# EAGLE board msc_onlab106 (EAGLE 6.1)
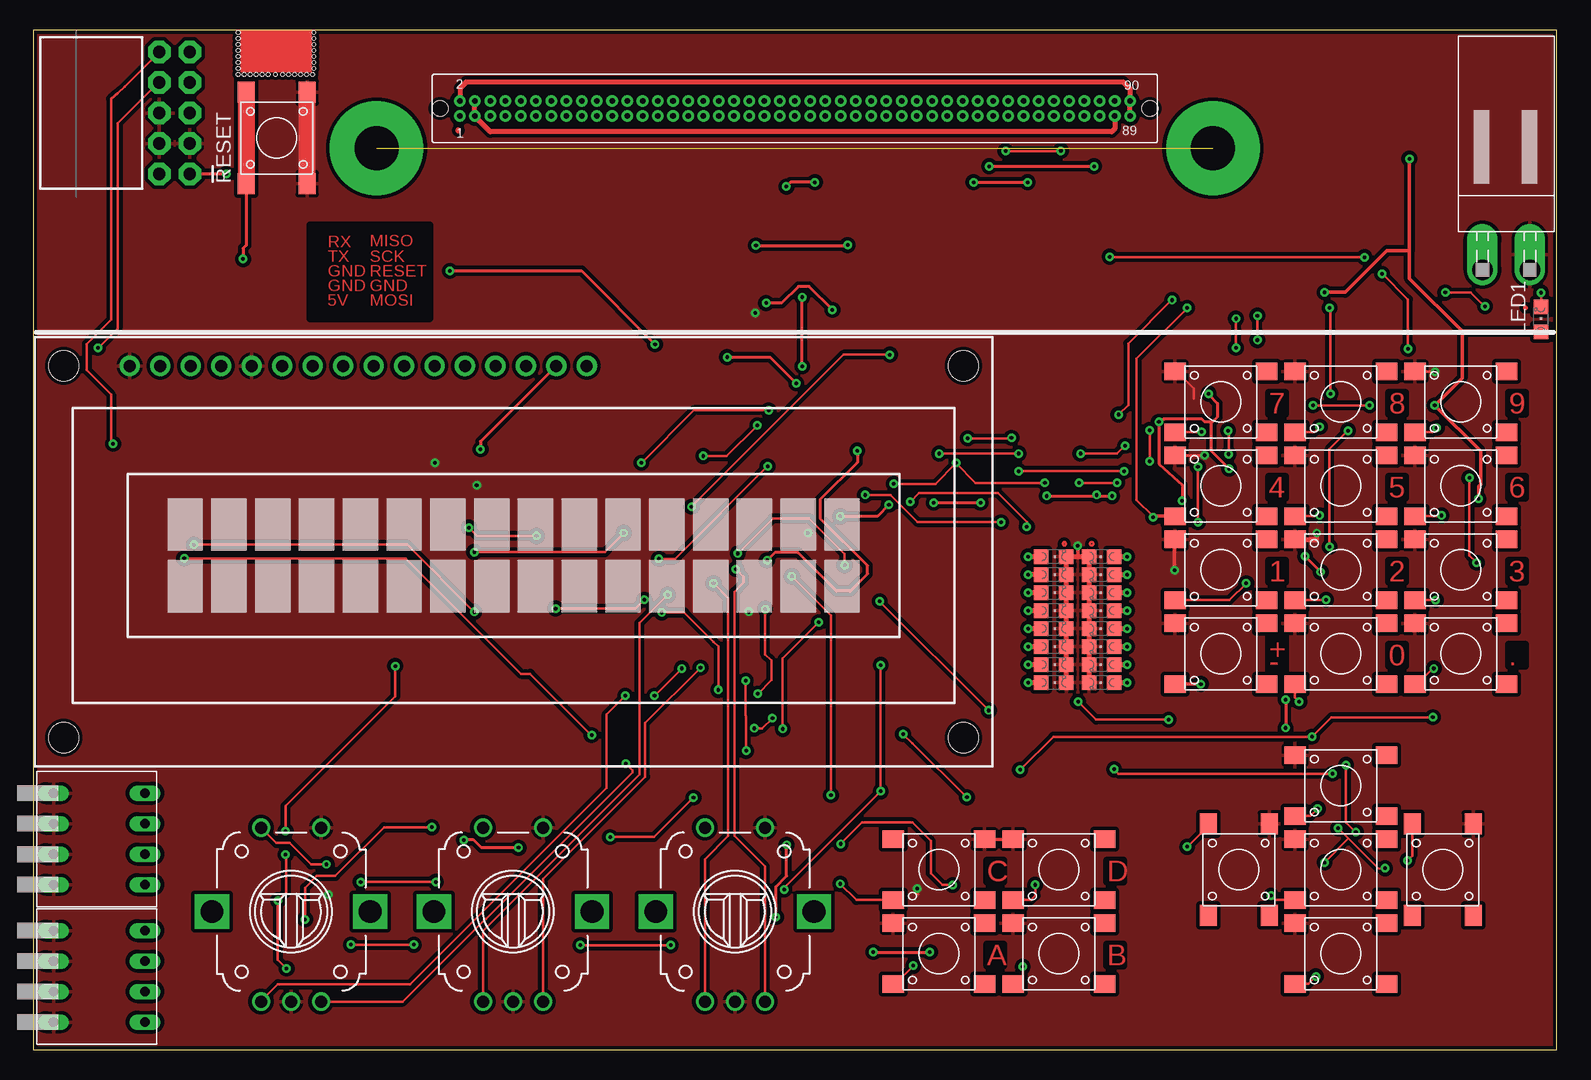
[diagram p2: board, top side]
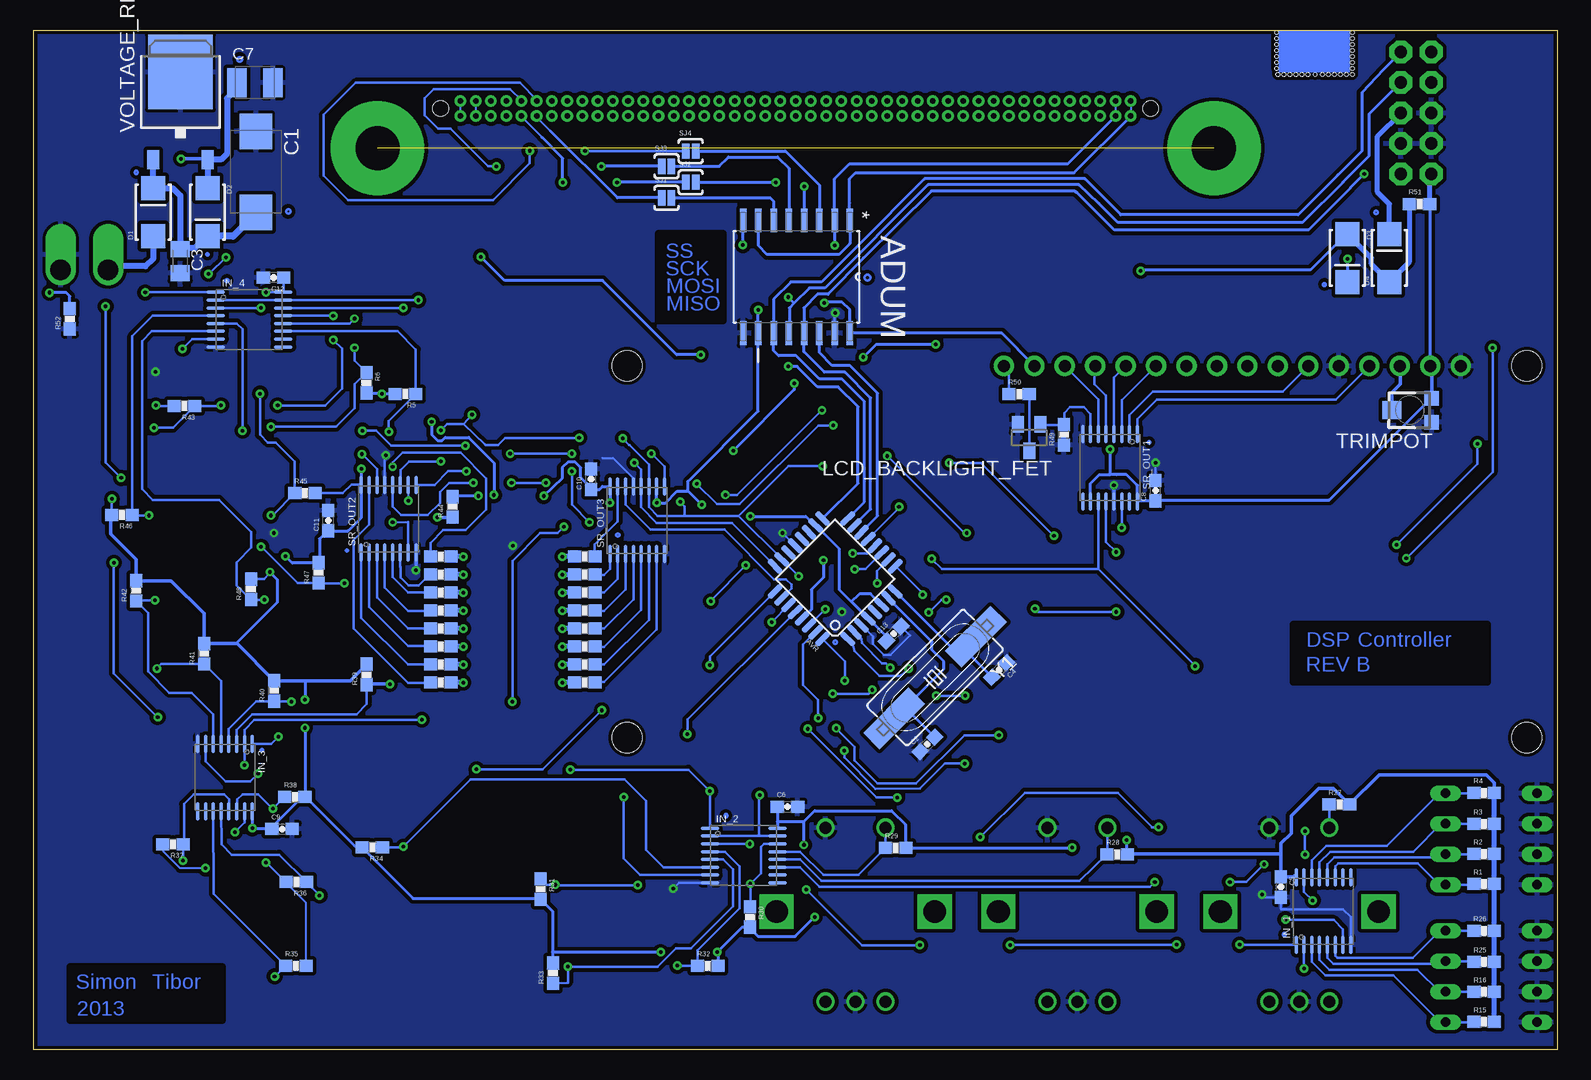
[diagram p3: board, bottom side, seen from below]

Size 127 x 85 mm. Coordinates in mm from the lower left corner, seen from the top.
Outline: 0,0 127,0 127,85 0,85 0,0
Copper layers (1*16): Top 0.035mm / dielectric 1.5mm / Bottom 0.035mm
Design rules: minimum track width 7mil, minimum drill 0.3mm, track to track 8mil, track to pad 8mil, pad to pad 7mil, via to via 7mil, smd to smd 7mil, copper to edge 10mil, drill to drill 7mil, minimum pad ring 10mil, minimum via ring 8mil, stop-mask expansion 2mil, vias tented up to drill 30mil, thermal gap 10mil
Holes 0.3 mm at 17.1,84.8 17.1,84.3 17.1,83.8 17.1,83.3 17.1,82.8 17.1,82.3 17.1,81.8 17.1,81.3 17.6,81.3 18.1,81.3 18.6,81.3 19.1,81.3 19.6,81.3 20.2,81.3 20.8,81.3 21.3,81.3 21.8,81.3 22.3,81.3 22.8,81.3 23.3,81.3 23.4,81.8 23.4,82.3 23.4,82.8 23.4,83.3 23.4,83.8 23.4,84.3 23.4,84.8
tRestrict: area 23.1,60.9 to 33.1,68.7
bRestrict: area 5.8,30.6 to 22,35.4; area 111.3,2.4 to 124,6.9; area 69.5,60.8 to 74.9,68

## Footprints (pad centres in the part's own frame; a part is rotated, then mirrored left to right if it is on the bottom)
SMD = smd 1.778 x 1.422: P$1 3.81,-2.54; P$2 -3.81,-2.54; P$3 3.81,2.54; P$4 -3.81,2.54
SOIC127P1032X265-16N = smd 1.981 x 0.533: 1 -4.699,4.445; 2 -4.699,3.175; 3 -4.699,1.905; 4 -4.699,0.635; 5 -4.699,-0.635; 6 -4.699,-1.905; 7 -4.699,-3.175; 8 -4.699,-4.445; 9 4.699,-4.445; 10 4.699,-3.175; 11 4.699,-1.905; 12 4.699,-0.635; 13 4.699,0.635; 14 4.699,1.905; 15 4.699,3.175; 16 4.699,4.445
TQFP32-08 = smd 1.524 x 0.559: 1 -4.293,2.8; 2 -4.293,2; 3 -4.293,1.2; 4 -4.293,0.4; 5 -4.293,-0.4; 6 -4.293,-1.2; 7 -4.293,-2; 8 -4.293,-2.8; 17 4.293,-2.8; 18 4.293,-2; 19 4.293,-1.2; 20 4.293,-0.4; 21 4.293,0.4; 22 4.293,1.2; 23 4.293,2; 24 4.293,2.8 | smd 0.559 x 1.524: 9 -2.8,-4.293; 10 -2,-4.293; 11 -1.2,-4.293; 12 -0.4,-4.293; 13 0.4,-4.293; 14 1.2,-4.293; 15 2,-4.293; 16 2.8,-4.293; 25 2.8,4.293; 26 2,4.293; 27 1.2,4.293; 28 0.4,4.293; 29 -0.4,4.293; 30 -1.2,4.293; 31 -2,4.293; 32 -2.8,4.293
D/7343-31W = smd 2.95 x 2.7: + 3.375,0; - -3.375,0
0603-CAP = smd 1.1 x 1: 1 -0.85,0; 2 0.85,0
C0805K = smd 1.3 x 1.6: 1 -1,0; 2 1,0
SMC_B = smd 1.6 x 2.4: + -1.5,0; - 1.5,0
SAMTEC-TFC = drill 0.46 pad 0.9: 1 27.94,0.635; 2 27.94,-0.635; 3 26.67,0.635; 4 26.67,-0.635; 5 25.4,0.635; 6 25.4,-0.635; 7 24.13,0.635; 8 24.13,-0.635; 9 22.86,0.635; 10 22.86,-0.635; 11 21.59,0.635; 12 21.59,-0.635; 13 20.32,0.635; 14 20.32,-0.635; 15 19.05,0.635; 16 19.05,-0.635; 17 17.78,0.635; 18 17.78,-0.635; 19 16.51,0.635; 20 16.51,-0.635; 21 15.24,0.635; 22 15.24,-0.635; 23 13.97,0.635; 24 13.97,-0.635; 25 12.7,0.635; 26 12.7,-0.635; 27 11.43,0.635; 28 11.43,-0.635; 29 10.16,0.635; 30 10.16,-0.635; 31 8.89,0.635; 32 8.89,-0.635; 33 7.62,0.635; 34 7.62,-0.635; 35 6.35,0.635; 36 6.35,-0.635; 37 5.08,0.635; 38 5.08,-0.635; 39 3.81,0.635; 40 3.81,-0.635; 41 2.54,0.635; 42 2.54,-0.635; 43 1.27,0.635; 44 1.27,-0.635; 45 0,0.635; 46 0,-0.635; 47 -1.27,0.635; 48 -1.27,-0.635; 49 -2.54,0.635; 50 -2.54,-0.635; 51 -3.81,0.635; 52 -3.81,-0.635; 53 -5.08,0.635; 54 -5.08,-0.635; 55 -6.35,0.635; 56 -6.35,-0.635; 57 -7.62,0.635; 58 -7.62,-0.635; 59 -8.89,0.635; 60 -8.89,-0.635; 61 -10.16,0.635; 62 -10.16,-0.635; 63 -11.43,0.635; 64 -11.43,-0.635; 65 -12.7,0.635; 66 -12.7,-0.635; 67 -13.97,0.635; 68 -13.97,-0.635; 69 -15.24,0.635; 70 -15.24,-0.635; 71 -16.51,0.635; 72 -16.51,-0.635; 73 -17.78,0.635; 74 -17.78,-0.635; 75 -19.05,0.635; 76 -19.05,-0.635; 77 -20.32,0.635; 78 -20.32,-0.635; 79 -21.59,0.635; 80 -21.59,-0.635; 81 -22.86,0.635; 82 -22.86,-0.635; 83 -24.13,0.635; 84 -24.13,-0.635; 85 -25.4,0.635; 86 -25.4,-0.635; 87 -26.67,0.635; 88 -26.67,-0.635; 89 -27.94,0.635; 90 -27.94,-0.635 | hole 1.3: -29.6,0; 29.587,0
SMA-DIODE_ALT = smd 2 x 2: A -2,0; C 2,0
DIP04PIANO = drill 0.8 long: 11 -3.81,-2.69; 12 -3.81,4.93; 21 -1.27,-2.69; 22 -1.27,4.93; 31 1.27,-2.69; 32 1.27,4.93; 41 3.81,-2.69; 42 3.81,4.93
PEC12_INCREMENTAL_ENCODER = drill 1: A -2.5,-7.5; B 2.5,-7.5; C 0,-7.5; P1 -2.5,7; P2 2.5,7 | drill 1.9 square: GND@1 -6.6,0; GND@2 6.6,0
TI_PW = smd 0.3 x 1.55: 1 -2.275,-2.8; 2 -1.625,-2.8; 3 -0.975,-2.8; 4 -0.325,-2.8; 5 0.325,-2.8; 6 0.975,-2.8; 7 1.625,-2.8; 8 2.275,-2.8; 9 2.275,2.825; 10 1.625,2.825; 11 0.975,2.825; 12 0.325,2.825; 13 -0.325,2.825; 14 -0.975,2.825; 15 -1.625,2.825; 16 -2.275,2.825
TUXGR_16X2_R2 = drill 1 pad 1.676: 1 -32,15.5; 2 -29.46,15.5; 3 -26.92,15.5; 4 -24.38,15.5; 5 -21.84,15.5; 6 -19.3,15.5; 7 -16.76,15.5; 8 -14.22,15.5; 9 -11.68,15.5; 10 -9.14,15.5; 11 -6.6,15.5; 12 -4.06,15.5; 13 -1.52,15.5; 14 1.02,15.5; 15 3.56,15.5; 16 6.1,15.5 | hole 2.5: -37.5,-15.5; 37.5,-15.5; -37.5,15.5; 37.5,15.5
SOT23 = smd 1 x 1.4: 1 -0.95,-1.1; 2 0.95,-1.1; 3 0,1.1
CHIPLED_0805 = smd 1.2 x 1.2: A 0,-1.05; C 0,1.05
NSL39_2_CONNECTOR = drill 1.7 offset: P$1 0,1.98; P$2 0,-1.98
2X5-RAF = drill 1.016 pad 1.88 octagon: 1 -1.27,5.08; 2 1.27,5.08; 3 -1.27,2.54; 4 1.27,2.54; 5 -1.27,0; 6 1.27,0; 7 -1.27,-2.54; 8 1.27,-2.54; 9 -1.27,-5.08; 10 1.27,-5.08
0603-RES = smd 1.1 x 1: 1 -0.85,0; 2 0.85,0
SJ_2S-NOTRACE = smd 0.635 x 1.27: 1 -0.401,0; 2 0.413,0
TC33X = smd 1.2 x 1.2: 1 -1,-1.825; 3 1,-1.825 | smd 1.5 x 1.6: 2 0,1.5
TO252 = smd 1 x 1.6: 1 -2.28,-4.8; 2 2.28,-4.8 | smd 5.4 x 6.2: 3 0,2.5
HC49UP = smd 5.334 x 1.93: 1 -4.826,0; 2 4.826,0

## Placement (x,y rotation side)
A1  TACTM-67N  [SMD]  109,22 0 top
A2  TACTM-67N  [SMD]  100.5,15 270 top
A3  TACTM-67N  [SMD]  109,15 0 top
A4  TACTM-67N  [SMD]  117.5,15 270 top
A5  TACTM-67N  [SMD]  109,8 0 top
ADUM  ADUM1401BRWZ  [SOIC127P1032X265-16N]  63.43,64.42 270 bottom
AVR  ATMEGA168  [TQFP32-08]  60.21,39.24 135 bottom
C1  47u  [D/7343-31W]  108.49,73.18 270 bottom
C2  22p  [0603-CAP]  52.51,25.44 45 bottom
C3  100n  [C0805K]  114.8,65.73 270 bottom
C4  22p  [0603-CAP]  46.54,31.65 225 bottom
C5  1u  [0603-CAP]  23.05,13.55 270 bottom
C6  1u  [0603-CAP]  64.18,20.24 0 bottom
C7  22u  [SMC_B]  108.57,80.61 0 bottom
C8  1u  [0603-CAP]  33.5,46.6 90 bottom
C9  1u  [0603-CAP]  106.31,18.38 0 bottom
C10  1u  [0603-CAP]  80.55,47.55 90 bottom
C11  1u  [0603-CAP]  102.45,44.1 90 bottom
C12  1u  [0603-CAP]  107.02,64.35 180 bottom
C13  1u  [0603-CAP]  55.33,34.67 45 bottom
CONNECTOR  SAMTEC_TFC  [SAMTEC-TFC]  63.5,78.46 180 top
D1  TACTM-67N  [SMA-DIODE_ALT]  117.05,69.81 90 bottom
D2  TACTM-67N  [SMA-DIODE_ALT]  112.53,69.81 270 bottom
D3  TACTM-67N  [SMA-DIODE_ALT]  17.5,66 270 bottom
D4  TACTM-67N  [SMA-DIODE_ALT]  14,66 90 bottom
DIP1  DIP04PIANO  [DIP04PIANO]  4.39,17.55 270 top
DIP2  DIP04PIANO  [DIP04PIANO]  4.39,6.09 270 top
E1  ENCODER_SW1-PEC12  [PEC12_INCREMENTAL_ENCODER]  21.5,11.5 0 top
E2  ENCODER_SW1-PEC12  [PEC12_INCREMENTAL_ENCODER]  40,11.5 0 top
E3  ENCODER_SW1-PEC12  [PEC12_INCREMENTAL_ENCODER]  58.5,11.5 0 top
F1  TACTM-67N  [SMD]  75.5,15 0 top
F2  TACTM-67N  [SMD]  85.5,15 0 top
F3  TACTM-67N  [SMD]  75.5,8 0 top
F4  TACTM-67N  [SMD]  85.5,8 0 top
IN_1  74HC165  [TI_PW]  19.5,11.54 0 bottom
IN_2  74HC165  [TI_PW]  67.85,16.17 270 bottom
IN_3  74HC165  [TI_PW]  111.07,22.67 180 bottom
IN_4  74HC165  [TI_PW]  109.04,60.86 270 bottom
LCD  RC-1602-BB  [TUXGR_16X2_R2]  40.05,41.5 0 top
LCD_BACKLIGHT_FET  BSS 138  [SOT23]  44.03,51.02 180 bottom
LED1  [CHIPLED_0805]  125.68,60.87 0 top
LED17  OF-SMD 2012 R/Y/G  [CHIPLED_0805]  89.08,30.59 90 top
LED18  OF-SMD 2012 R/Y/G  [CHIPLED_0805]  89.08,32.09 90 top
LED19  OF-SMD 2012 R/Y/G  [CHIPLED_0805]  89.08,33.59 90 top
LED20  OF-SMD 2012 R/Y/G  [CHIPLED_0805]  89.08,35.09 90 top
LED21  OF-SMD 2012 R/Y/G  [CHIPLED_0805]  89.08,36.59 90 top
LED22  OF-SMD 2012 R/Y/G  [CHIPLED_0805]  89.08,38.09 90 top
LED23  OF-SMD 2012 R/Y/G  [CHIPLED_0805]  89.08,39.59 90 top
LED24  OF-SMD 2012 R/Y/G  [CHIPLED_0805]  89.08,41.09 90 top
LED25  OF-SMD 2012 R/Y/G  [CHIPLED_0805]  85.08,41.09 270 top
LED26  OF-SMD 2012 R/Y/G  [CHIPLED_0805]  85.08,39.59 270 top
LED27  OF-SMD 2012 R/Y/G  [CHIPLED_0805]  85.08,38.09 270 top
LED28  OF-SMD 2012 R/Y/G  [CHIPLED_0805]  85.08,36.59 270 top
LED29  OF-SMD 2012 R/Y/G  [CHIPLED_0805]  85.08,35.09 270 top
LED30  OF-SMD 2012 R/Y/G  [CHIPLED_0805]  85.08,33.59 270 top
LED31  OF-SMD 2012 R/Y/G  [CHIPLED_0805]  85.08,32.09 270 top
LED32  OF-SMD 2012 R/Y/G  [CHIPLED_0805]  85.08,30.59 270 top
N1  TACTM-67N  [SMD]  99,54 0 top
N2  TACTM-67N  [SMD]  109,54 0 top
N3  TACTM-67N  [SMD]  119,54 0 top
N4  TACTM-67N  [SMD]  99,47 0 top
N5  TACTM-67N  [SMD]  109,47 0 top
N6  TACTM-67N  [SMD]  119,47 0 top
N7  TACTM-67N  [SMD]  99,40 0 top
N8  TACTM-67N  [SMD]  109,40 0 top
N9  TACTM-67N  [SMD]  119,40 0 top
N10  TACTM-67N  [SMD]  99,33 0 top
N11  TACTM-67N  [SMD]  109,33 0 top
N12  TACTM-67N  [SMD]  119,33 0 top
POWER_CONNECTOR  NSL39_2_CONNECTOR  [NSL39_2_CONNECTOR]  122.79,64.99 270 top
PROGRAMMING_CONNECTOR  M05X2RAF  [2X5-RAF]  11.78,78.08 180 top
R1  10k  [0603-RES]  6.1,13.8 0 bottom
R2  10k  [0603-RES]  6.1,16.3 0 bottom
R3  10k  [0603-RES]  6.1,18.8 0 bottom
R4  10k  [0603-RES]  6.1,21.4 0 bottom
R5  10k  [0603-RES]  96.03,54.66 180 bottom
R6  10k  [0603-RES]  99.28,55.6 270 bottom
R7  1k  [0603-RES]  93.08,30.59 0 bottom
R8  1k  [0603-RES]  93.08,32.09 0 bottom
R9  1k  [0603-RES]  93.08,33.59 0 bottom
R10  1k  [0603-RES]  93.08,35.09 0 bottom
R11  1k  [0603-RES]  93.08,36.59 0 bottom
R12  1k  [0603-RES]  93.08,38.09 0 bottom
R13  1k  [0603-RES]  93.08,39.59 0 bottom
R14  1k  [0603-RES]  93.08,41.09 0 bottom
R15  10k  [0603-RES]  6.1,2.3 0 bottom
R16  10k  [0603-RES]  6.1,4.8 0 bottom
R17  1k  [0603-RES]  81.08,41.09 180 bottom
R18  1k  [0603-RES]  81.08,39.59 180 bottom
R19  1k  [0603-RES]  81.08,38.09 180 bottom
R20  1k  [0603-RES]  81.08,36.59 180 bottom
R21  1k  [0603-RES]  81.08,35.09 180 bottom
R22  1k  [0603-RES]  81.08,33.59 180 bottom
R23  1k  [0603-RES]  81.08,32.09 180 bottom
R24  1k  [0603-RES]  81.08,30.59 180 bottom
R25  10k  [0603-RES]  6.1,7.3 0 bottom
R26  10k  [0603-RES]  6.1,9.9 0 bottom
R27  10k  [0603-RES]  18.18,20.43 0 bottom
R28  10k  [0603-RES]  36.69,16.27 0 bottom
R29  10k  [0603-RES]  55.15,16.82 0 bottom
R30  10k  [0603-RES]  67.31,11.06 270 bottom
R31  10k  [0603-RES]  84.76,13.37 270 bottom
R32  10k  [0603-RES]  70.82,6.98 0 bottom
R33  10k  [0603-RES]  83.71,6.36 90 bottom
R34  10k  [0603-RES]  98.79,16.86 180 bottom
R35  10k  [0603-RES]  105.16,6.98 0 bottom
R36  10k  [0603-RES]  105.13,13.96 180 bottom
R37  10k  [0603-RES]  115.41,17.12 180 bottom
R38  10k  [0603-RES]  105.25,21.06 0 bottom
R39  10k  [0603-RES]  99.26,31.27 90 bottom
R40  10k  [0603-RES]  106.98,29.9 90 bottom
R41  10k  [0603-RES]  112.81,32.99 90 bottom
R42  10k  [0603-RES]  118.47,38.24 90 bottom
R43  10k  [0603-RES]  114.45,53.64 180 bottom
R44  10k  [0603-RES]  92.08,45.24 90 bottom
R45  10k  [0603-RES]  104.39,46.39 0 bottom
R46  10k  [0603-RES]  119.66,44.58 180 bottom
R47  10k  [0603-RES]  103.26,39.74 90 bottom
R48  10k  [0603-RES]  108.91,38.36 90 bottom
R49  10k  [0603-RES]  41.14,51.24 90 bottom
R50  20  [0603-RES]  44.88,54.64 0 bottom
R51  10k  [0603-RES]  11.5,70.5 0 bottom
R52  550  [0603-RES]  124,60.93 90 bottom
RESET  NSG 39-2  [SMD]  20.3,76 90 top
SJ1  SOLDERJUMPERNC2  [SJ_2S-NOTRACE]  74.26,71 0 bottom
SJ2  SOLDERJUMPERNC2  [SJ_2S-NOTRACE]  72.25,72.3 0 bottom
SJ3  SOLDERJUMPERNC2  [SJ_2S-NOTRACE]  74.26,73.64 0 bottom
SJ4  SOLDERJUMPERNC2  [SJ_2S-NOTRACE]  72.25,74.9 0 bottom
SR_OUT1  74HC595  [TI_PW]  37.29,48.51 180 bottom
SR_OUT2  74HC595  [TI_PW]  97.42,44.25 0 bottom
SR_OUT3  74HC595  [TI_PW]  76.7,44.12 0 bottom
TRIMPOT  10k  [TC33X]  12.3,53.3 90 bottom
VOLTAGE_REGULATOR  7805DT  [TO252]  114.78,78.99 0 bottom
Y1  16MHz  [HC49UP]  51.88,31.01 225 bottom

## Tracks (layer width: path | path; a pad name or v marks a point on that pad's centre or on a via)
3V3
  Top 0.254: 35.55,79.1 CONNECTOR.2
  Top 0.406: CONNECTOR.89 91.44,79.06 91.45,79.06 91.45,80.08 90.88,80.65 36.08,80.65 35.59,80.16 35.59,79.14 35.55,79.1
  Bottom 0.178: CONNECTOR.90 CONNECTOR.89 | CONNECTOR.2 CONNECTOR.1
  Bottom 0.254: CONNECTOR.1 40.28,73.1 58.5,73.1 59,72.6 59,70.58 ADUM.1 58.99,67.2 59.9,66.29 65.88,66.29 66.59,67 66.59,69.1 ADUM.7
3V3_GND  (via drill 0.3)
  Top 0.254: 36.81,79.1 36.82,79.1 CONNECTOR.4 | v60.26,67.04 67.86,67.04 v67.89,67.07
  Top 0.406: CONNECTOR.87 90.17,76.77 89.9,76.5 38.11,76.5 36.81,77.8 36.81,79.1
  Bottom 0.178: CONNECTOR.88 CONNECTOR.87 | CONNECTOR.4 CONNECTOR.3
  Bottom 0.254: CONNECTOR.3 40.8,73.85 59,73.85 60.26,72.59 ADUM.2 v60.26,67.04 | v67.89,67.07 67.89,69.1 ADUM.8
5V  (via drill 0.3)
  Top 0.178: 43.55,56.96 LCD.15 | v112.69,15.11 112.12,15.11 109.65,17.59 | v108.79,18.44 109.65,17.59 | 109.65,17.59 v107.66,15.6 | 98.31,52.33 98.23,52.33 | 97.99,54.6 v97.99,54.68 | v88.64,46.23 88.64,46.15 | v93.84,52.33 93.92,52.24 93.84,52.24
  Top 0.203: v97.99,54.68 97.83,54.68 | v116.84,53.71 116.76,53.71 116.67,53.62 | v120.49,45.91 120.49,45.74 | v107.66,63.13 107.58,63.13 | v95.79,45.74 95.79,45.91
  Top 0.254: v61.1,62.24 62.4,62.24 63.78,63.62 64.67,63.62 v66.62,61.67 | v37.29,50.05 37.29,50.7 43.55,56.96 | v70.04,8.12 v74.75,8.12 | v62.81,17.06 62.81,14.46 61.91,13.57 v61.91,11.05 | v84.5,46.15 88.64,46.15 v89.94,46.15 | v78.97,45.58 v75.08,45.58 | v67.28,44.44 70.36,44.44 v71.34,45.42 | v95.79,45.74 95.79,47.04 93.84,48.83 93.84,52.24 94.25,52.57 97.42,52.57 97.66,52.33 98.23,52.33 98.23,49.89 v99.69,48.42 | 98.31,52.33 98.72,52.73 98.72,53.87 97.99,54.6 | v106.03,41.11 v107.33,39.81 | v104.41,29.17 v104.41,26.81 | v35.91,17.47 36.73,17.47 37.38,16.82 v40.46,16.82
  Top 0.305: v114.72,74.26 114.72,66.62 | 119.11,59.88 114.72,64.27 114.72,66.62 | 119.11,59.88 125.61,59.88 LED1.A | LED1.A | LED1.A 125.69,59.8 | 114.72,66.62 112.86,66.62 109.36,63.13 v107.66,63.13 | 119.11,59.88 119.11,55.98 v116.84,53.71 120.66,49.89 120.66,47.12 120.49,46.96 v120.49,45.91
  Bottom 0.178: 66.62,59.88 66.54,59.8 ADUM.10 66.62,59.64 | 58.99,59.8 ADUM.16 58.91,59.72 | 10.64,57.12 LCD.2 | 10.64,70.36 R51.2 | 38.92,46.31 SR_OUT1.10 | 36.64,47.94 36.73,47.94 | 10.89,53.95 10.56,54.19 TRIMPOT.3 | 33.48,45.83 C8.1 | 43.63,57.04 LCD.15 | 54.36,16.82 R29.2 54.27,16.82 | 83.77,7.23 R33.2 | 84.74,12.51 R31.2 84.83,12.59 | 69.96,6.99 R32.2 | v70.04,8.12 69.96,8.12 | 67.44,10.56 R30.2 | 92.06,46.15 R44.2 | 80.52,46.8 C10.1 | 61.91,43.71 AVR.18 | 74.99,45.58 v75.08,45.58 | 100.18,16.9 99.69,16.9 R34.2 99.61,16.82 | 104.33,21.04 R38.2 | R35.2 104.33,6.99 104.33,12.27 105.95,13.89 R36.2 106.03,13.97 v107.66,15.6 | 107.58,18.44 107.17,18.61 C9.1 107.09,18.61 | 108.79,19.82 IN_3.16 | v112.69,15.11 114.81,15.11 116.19,16.49 116.19,17.06 R37.2 | 104.65,21.04 104.49,21.04 R38.2 | v95.79,45.74 95.79,47.04 SR_OUT2.10 | 103.19,40.62 R47.2 103.27,40.54 | 102.54,43.23 C11.1 | 108.88,39.24 R48.2 | 99.69,47.12 SR_OUT2.16 | 110.01,33.96 110.07,33.84 | 104.41,21.12 R38.2
  Bottom 0.203: 97.96,54.66 v97.99,54.68 | v97.99,54.69 v97.99,54.68 | R43.2 116.78,53.64 v116.84,53.71 | 98.06,54.75 v97.99,54.68 | R46.2 120.51,45.89 v120.49,45.91 | IN_4.16 106.28,63.13 | 106.28,63.13 v107.66,63.13 | 21.9,14.4 21.8,14.3 21.8,14.35 21.79,14.35 IN_1.16 | C13.1 55.93,34.43 | 57.45,35.95 57.35,35.85 57.38,35.85 AVR.4 | 34.9,45.75 35,45.65 35,45.7 SR_OUT1.16 | SR_OUT3.16 | SR_OUT2.16 99.69,47.04 99.78,47.12 100.51,47.12 101.24,46.39 R45.2 | SR_OUT2.16 99.7,47.12 99.69,47.12 SR_OUT2.16 | 65.03,18.46 IN_2.16 | C12.1 106.17,63.24 106.28,63.13 | 35.9,16.74 R28.2 | 61.02,62.32 v61.1,62.24 | 108.88,39.24 107.82,39.24 107.33,39.73 v107.33,39.81
  Bottom 0.254: R5.2 97.96,54.66 | R6.2 98.06,54.75 | AVR.18 61.81,43.69 59.88,41.76 59.88,38.35 AVR.4 57.45,35.96 58.83,37.33 58.17,37.98 57.24,37.98 AVR.6 | 55.93,34.43 57.35,35.85 | C8.1 34.9,45.75 | C10.1 79.85,46.7 79.6,46.95 SR_OUT3.16 | C11.1 100.81,43.25 99.69,44.36 99.69,47.04 | C6.1 65.03,19.01 | 65.03,19.01 65.03,18.46 | 66.62,59.88 v66.62,61.67 | 10.64,70.36 10.64,57.12 | 37.29,47.94 36.73,47.94 35.91,47.94 35,47.02 35,45.7 | v37.29,50.05 37.29,47.94 | 10.89,53.95 19.01,45.83 33.48,45.83 | 58.91,59.72 46.31,59.72 43.63,57.04 | 54.36,16.82 54.36,18.77 55.49,19.91 61.91,19.91 62.81,19.01 | 65.03,19.01 62.81,19.01 | 83.77,8.12 83.77,11.54 84.74,12.51 | 83.77,8.12 83.77,7.23 | 69.96,8.12 69.96,6.99 | v74.75,8.12 83.77,8.12 | v62.81,17.06 62.81,19.01 | v61.91,11.05 63.54,9.43 66.62,9.43 67.36,10.16 R30.2 | v89.94,46.15 92.06,46.15 | v84.5,46.15 82.96,47.61 82.96,48.51 82.47,48.99 81.9,48.99 81.41,48.51 81.41,47.69 80.52,46.8 | v75.08,45.58 SR_OUT3.10 | SR_OUT3.16 v78.97,45.58 | 61.91,43.71 62.64,44.44 v67.28,44.44 | 72.47,46.56 v71.34,45.42 | 72.47,46.56 73.37,46.56 74.34,45.58 74.99,45.58 | 104.33,21.04 100.18,16.9 | 107.09,18.61 104.65,21.04 | 103.19,40.62 103.19,42.58 102.54,43.23 | 99.69,47.12 v99.69,48.42 | 110.01,33.96 106.68,37.29 106.68,39.16 v107.33,39.81 | v104.41,26.81 104.41,21.12 | 104.41,30.75 v104.41,29.17 | v88.64,46.23 88.64,48.91 90.76,51.02 92.71,51.02 92.95,50.78 93.36,50.78 93.84,51.27 v93.84,52.33 | 84.83,12.59 95.39,12.59 99.61,16.82 | 54.27,16.82 v40.46,16.82 | 66.62,59.64 66.62,53.22 72.47,47.37 72.47,46.56 | 58.99,59.8 58.99,61.67 59.64,62.32 61.02,62.32 | 103.27,40.54 105.46,40.54 v106.03,41.11
  Bottom 0.254: 107.58,18.44 v108.79,18.44 108.79,19.82 | 35.9,16.74 35.9,17.46 v35.91,17.47 | R30.2 67.96,10.21 v70.04,8.12 | R30.2 67.28,10.24 | 38.92,46.31 38.92,47.21 38.19,47.94 37.29,47.94
  Bottom 0.305: TRIMPOT.3 10.47,56.88 LCD.2 | D2.A 112.53,74.26 v114.72,74.26 | R46.2 120.58,44.51 120.58,42.98 118.47,40.88 R42.2 115.54,39.08 112.81,36.36 R41.2 110.07,33.84 R40.2 104.41,30.75 100.62,30.75 R39.2 | R4.2 5.25,22.23 5.93,22.91 14.84,22.91 R27.2 18.68,21.77 19.91,21.77 22.18,19.5 22.18,18.04 23.05,17.17 23.05,16.31 | 21.88,14.4 C5.1 23.05,16.31 | 21.88,14.4 21.86,14.38 | 21.88,14.4 21.94,14.46 21.88,14.46 IN_1.16 | 23.05,16.31 35.47,16.31 R28.2
  Bottom 0.406: R51.2 10.65,72.86 PROGRAMMING_CONNECTOR.2 | R15.2 R16.2 R25.2 R26.2 R1.2 R2.2 R3.2 R4.2
  Bottom 0.508: D2.A 112.5,71.83 VOLTAGE_REGULATOR.2 111.4,74.2 110.9,74.7 110.9,79.3 110.07,80.13 C7.+
CLK3
  Bottom 0.254: SJ3.2 69.88,73.64 69.09,74.42 65,74.42 64.06,73.47 64.06,69.18 64.09,69.15 64.09,69.14 ADUM.5
GND  (via drill 0.3)
  Top 0.203: N4.P$4 96.46,49.54 v97.65,49.54 | 106.83,49.54 106.88,49.5 | N3.P$4 116.83,56.54 | N1.P$4 95.32,56.54 96.77,55.09 96.77,54.27 | v24.62,12.92 24.7,12.92 24.78,12.84 | v33.48,48.91 33.48,48.99 | v60.21,61.42 60.21,61.1 | v73.69,13.41 73.69,13 73.78,12.92 | v64.59,43.06 64.51,43.14
  Top 0.254: F1.P$3 81.56,17.54 81.6,17.5 81.7,17.5 | 81.8,17.5 81.7,17.5 | 81.7,17.5 F2.P$4
  Top 0.305: LED25.C 87.08,41.09 87.08,41.11 v87.08,42.01 | v95.14,39.98 95.14,42.49 95.22,42.58 | v36.97,47.04 36.97,46.8
  Top 0.406: LED17.C LED18.C LED19.C LED20.C LED21.C LED22.C LED23.C LED24.C LED25.C LED26.C LED27.C LED28.C LED29.C LED30.C LED31.C LED32.C | N8.P$4 107.01,42.54 v107.01,43.06
  Top 1.42: RESET.P$2 RESET.P$1
  Bottom 0.178: SR_OUT3.13 77.03,47.61 78.73,49.32 79.62,49.32 | 80.52,48.42 C10.2
  Bottom 0.203: SR_OUT2.13 97.75,49.44 v97.65,49.54 | AVR.3 57.95,35.36 57.04,34.45 57.04,33.8 56.14,32.91 55.58,32.91 53.95,34.53 53.98,34.53 C13.2 | 17.23,8.69 17.23,11.05 17.88,11.7 22.99,11.7 23.05,11.76 C5.2 24.4,12.7 v24.62,12.92 | C8.2 33.5,48.89 v33.48,48.91 | ADUM.15 60.26,61.21 v60.21,61.42 | IN_2.8 73.2,13.9 v73.69,13.41 | AVR.21 v64.59,43.06
  Bottom 0.305: SR_OUT2.8 v95.15,39.98 v95.14,39.98 | SR_OUT1.13 v36.97,47.04
  Bottom 0.406: v107.01,43.06 106.92,43.06 106.92,42.98
  other vias: 116.88,56.5 59.64,36.48
  pour Bottom (isolate 0.305): 0,85 127,85 127,0 0,0
  pour Top (isolate 0.305): 0,85 127,85 127,0 0,0 0,0.1
IN1A
  Bottom 0.203: IN_1.11 18.52,15.28 18.28,15.52 11.62,15.52 9.8,13.7 9.4,13.7 | 9.4,13.7 8.09,13.7 8.05,13.74 7.01,13.74 R1.1 | DIP1.42 9.36,13.74 9.4,13.7
IN1B
  Bottom 0.203: IN_1.12 19.18,15.44 18.61,16.01 9.99,16.01 9.7,16.3 9.3,16.3 | 9.3,16.3 8.07,16.3 8.05,16.28 6.97,16.28 R2.1 | DIP1.32 9.3,16.3
IN1C
  Bottom 0.203: IN_1.13 19.82,15.6 18.93,16.49 12.01,16.49 9.7,18.8 9.3,18.8 | 9.3,18.8 8.1,18.8 | 8.1,18.8 8.07,18.8 | 8.07,18.8 8.05,18.82 8.05,18.85 8.1,18.8 | 8.07,18.8 R3.1 | DIP1.22 9.3,18.8
IN1D
  Bottom 0.203: IN_1.14 20.48,15.76 19.26,16.98 14.22,16.98 9.84,21.36 | 9.84,21.36 9.8,21.4 8.09,21.4 8.05,21.36 6.99,21.36 R4.1 | DIP1.12 9.84,21.36
IN1E
  Bottom 0.203: IN_1.3 20.48,7.31 19.34,6.17 13.68,6.17 9.8,2.3 | 9.8,2.3 8.06,2.3 8.05,2.28 6.97,2.28 R15.1 | DIP2.42 9.78,2.28 9.8,2.3
IN1F
  Bottom 0.203: IN_1.4 19.82,7.47 19.01,6.66 11.66,6.66 9.82,4.82 | 9.82,4.82 9.8,4.8 8.07,4.8 8.05,4.82 6.97,4.82 R16.1 | DIP2.32 9.82,4.82
IN1G
  Bottom 0.203: IN_1.5 19.18,7.64 18.69,7.15 9.85,7.15 9.7,7.3 | 9.7,7.3 8.11,7.3 8.05,7.36 7.01,7.36 R25.1 | DIP2.22 9.64,7.36 9.7,7.3
IN1H
  Bottom 0.203: IN_1.6 18.52,7.8 18.36,7.64 12.06,7.64 9.8,9.9 9.4,9.9 | 9.4,9.9 8.05,9.9 8,9.9 R26.1 | DIP2.12 9.4,9.9
IN2A  (via drill 0.3)
  Top 0.203: v33.56,13.97 v27.3,13.97 | 19.02,18.52 E1.P1 20.27,17.23 21.37,17.23 23.16,15.44 v24.46,15.44
  Bottom 0.203: R27.1 19.02,18.52 E1.P1 | IN_2.11 63.14,15.2 61.51,13.57 33.96,13.57 v33.56,13.97 | v27.3,13.97 25.92,13.97 v24.46,15.44
IN2B
  Bottom 0.203: E2.P1 37.52,16.38 R28.1 39.84,14.06 61.34,14.06 63.14,15.85 IN_2.12
IN2C
  Bottom 0.203: E3.P1 56,16.84 55.98,16.82 R29.1 58.27,14.54 61.18,14.54 63.14,16.5 IN_2.13
IN2D  (via drill 0.3)
  Top 0.203: F1.P$2 68.63,12.46 v67.28,13.81
  Bottom 0.203: R30.1 67.28,12.51 v67.28,13.81 66.38,14.71 66.38,16.9 66.13,17.15 IN_2.14
IN2E  (via drill 0.3)
  Top 0.203: v67.31,17.14 69.1,18.93 73.29,18.93 74.83,17.39 74.83,14.71 75.81,13.73 76.62,13.73 v76.65,13.7 | F2.P$2 83.16,12.46 83.55,12.85 83.55,13.71 v83.53,13.73
  Bottom 0.203: v67.31,17.14 IN_2.3 | 84.83,14.22 84.34,13.73 v83.53,13.73 83.49,13.7 v76.65,13.7
  Bottom 0.254: 84.83,14.22 R31.1 | R31.1 84.72,14.22 84.7,14.2 84.74,14.2 R31.1
IN2F  (via drill 0.3)
  Top 0.203: F3.P$2 71.84,5.46 v73.37,6.99
  Bottom 0.203: v73.37,6.99 R32.1 | R32.1 | R32.1 71.67,8.28 68.17,11.78 68.17,15.28 69.39,16.49 IN_2.4
IN2G  (via drill 0.3)
  Top 0.203: F4.P$2 82.49,5.86 v82.49,6.91
  Bottom 0.203: R33.1 83.71,5.53 82.49,5.58 v82.49,6.91 74.99,6.91 73.45,8.45 72.23,8.45 68.74,11.94 68.74,15.03 69.55,15.84 IN_2.5
IN2H  (via drill 0.3)
  Top 0.203: 97.96,18.82 97.58,18.44 97.58,18.28 v96.2,16.9 | 97.99,18.77 97.99,18.85 97.96,18.82 | A2.P$2 97.96,18.82
  Bottom 0.203: R34.1 96.48,16.86 v96.2,16.9 90.59,22.51 77.76,22.51 75.97,20.72 75.97,16.66 74.51,15.2 IN_2.6
IN3C  (via drill 0.3)
  Top 0.203: A4.P$2 114.96,16.16 v114.56,15.76
  Bottom 0.203: v114.56,15.76 R37.1 114.48,17.2 114.48,20.48 113.67,21.29 111.15,21.29 110.71,20.84 IN_3.13
IN3D  (via drill 0.3)
  Top 0.203: A1.P$2 106.48,19.46 v107.09,20.07
  Bottom 0.203: R38.1 v107.09,20.07 108.31,21.29 109.61,21.29 110.06,20.84 IN_3.14
IN3E  (via drill 0.3)
  Top 0.305: N10.P$2 v97.34,30.46 v97.34,30.47
  Bottom 0.203: R39.1 99.26,28.79 100.1,27.95 108.79,27.95 110.09,26.65 IN_3.3 110.09,25.43
  Bottom 0.305: v97.34,30.47 99.26,30.47 R39.1
IN3F  (via drill 0.3)
  Top 0.203: N11.P$2 105.19,29.36 v105.54,29.01
  Bottom 0.203: v105.54,29.01 106.94,29.01 R40.1 107.03,29.01 108.47,29.01 110.74,26.73 IN_3.4
IN3G  (via drill 0.3)
  Top 0.203: v116.76,31.77 116.67,31.77 115.38,30.47 N12.P$2
  Bottom 0.203: IN_3.5 111.39,30.72 R41.1 116.39,32.14 v116.76,31.77
IN3H  (via drill 0.3)
  Top 0.203: N9.P$2 v116.92,37.46
  Bottom 0.203: v116.92,37.46 118.4,37.46 R42.1 118.38,37.3 118.38,37.29 117.49,36.4 117.49,31.52 115.7,29.74 113.83,29.74 112.04,27.95 IN_3.6
IN4A  (via drill 0.3)
  Top 0.203: N1.P$2 97.37,51.46 v97.42,51.51
  Bottom 0.203: IN_4.11 96.69,59.88 95.17,58.37 R5.1 97.42,52.41 v97.42,51.51
IN4B  (via drill 0.3)
  Top 0.203: N2.P$2 106.79,51.46 v107.25,51.92 | v100.26,60.94 v100.26,58.5
  Bottom 0.203: v107.25,51.92 101.81,51.92 100.26,53.46 100.26,55.47 R6.1 99.29,56.47 100.26,57.44 v100.26,58.5 | IN_4.12 100.67,60.53 v100.26,60.94
IN4C  (via drill 0.3)
  Top 0.203: N3.P$2 116.62,51.46 v117,51.84 | v102.05,59.15 v102.05,61.18 | v111.39,53.71 v106.68,53.71
  Bottom 0.203: v117,51.84 115.41,51.84 R43.1 111.46,53.64 v111.39,53.71 | v102.05,61.18 IN_4.13 | v102.05,59.15 101.32,58.42 101.32,55.09 102.7,53.71 v106.68,53.71
IN4D  (via drill 0.3)
  Top 0.203: v96.2,61.83 91.97,57.61 91.97,45.83 93.34,44.46 93.38,44.46
  Top 0.305: N4.P$2 93.38,44.46 v93.38,44.38
  Bottom 0.203: v96.2,61.83 IN_4.14
  Bottom 0.305: v93.38,44.38 92.08,44.38 R44.1
IN4E  (via drill 0.3)
  Top 0.203: N5.P$2 107.19,44.46 v107.25,44.52 | v108.14,54.68 108.14,61.75 v108.06,61.83
  Bottom 0.203: v107.25,44.52 107.11,44.52 R45.1 105.24,49.02 106.84,50.62 107.49,50.62 108.14,51.27 v108.14,54.68 | v108.06,61.83 IN_4.3
IN4F  (via drill 0.3)
  Top 0.203: N6.P$2 117.34,44.46 v117.41,44.52
  Bottom 0.203: v117.41,44.52 118.79,44.52 118.79,44.56 | 118.79,44.56 118.79,59.48 117.08,61.18 IN_4.4 111.8,61.18 | 118.79,44.56 R46.1
IN4G  (via drill 0.3)
  Top 0.203: N7.P$2 99.71,37.46 v101.12,38.88 | v108.06,41.92 108.06,50.05 v109.61,51.59
  Bottom 0.203: v101.12,38.88 103.25,38.88 R47.1 105.03,38.89 v108.06,41.92 | v109.61,51.59 109.61,60.04 110.09,60.53 IN_4.5
IN4H  (via drill 0.3)
  Top 0.203: N8.P$2 107.58,37.46 v107.78,37.5
  Bottom 0.203: v107.78,37.5 108.89,37.5 R48.1 108.93,37.51 110.09,38.67 110.09,40.62 108.88,41.84 108.88,43.14 111.56,45.83 117.08,45.83 117.97,46.72 117.97,59.07 117.16,59.88 IN_4.6
IN_1  (via drill 0.3)
  Top 0.203: v22.67,10.85 22.67,13.49 23.64,14.46 25.19,14.46 29.25,18.52 v33.23,18.52 | v48.1,17.71 51.76,17.71 v55.05,21 | v62.48,26.73 62.48,32.62 v65.49,35.63
  Bottom 0.203: IN_1.7 17.88,10.03 18.65,10.81 22.63,10.81 v22.67,10.85 | 33.76,18.52 36.64,21.41 44.4,21.41 v48.1,17.71 | v55.05,21 56.75,21 v62.48,26.73 | v65.49,35.63 65.49,35.66 AVR.27 | v33.23,18.52 33.76,18.52 | 33.76,18.52 33.8,18.52
IN_2  (via drill 0.3)
  Top 0.203: v77.84,21.03 73.29,25.51 v72.52,26.28
  Bottom 0.203: IN_2.7 76.46,14.55 77.84,15.93 v77.84,21.03 | v72.52,26.28 72.52,27.5 AVR.28
IN_3  (via drill 0.3)
  Top 0.203: v108.31,22.99 90.47,22.99 v90.11,23.36 | v79.67,28.27 v70.57,37.38 | v58.74,41.36 61.67,44.28 64.67,44.28 67.64,41.32 v67.64,40.38
  Bottom 0.203: IN_3.7 112.69,24.01 111.03,22.34 108.96,22.34 v108.31,22.99 | v90.11,23.36 84.58,23.36 v79.67,28.27 | v70.57,37.38 70.57,37.46 v67.64,40.38 | v58.74,41.36 57.53,41.36 AVR.12
IN_4  (via drill 0.3)
  Top 0.203: v114.6,58.42 114.6,62.52 v112.45,64.67 | v71.42,57.93 67.56,57.93 v54.88,45.26 | v110.99,66.06 89.78,66.06 v89.74,66.1
  Bottom 0.203: IN_4.7 113.79,59.23 v114.6,58.42 | v54.88,45.26 54.88,45.13 AVR.13 | v112.45,64.67 112.37,64.67 v110.99,66.06
  Bottom 0.254: v71.42,57.93 73.41,57.93 79.58,64.11 87.75,64.11 v89.74,66.1
IN_LOAD  (via drill 0.3)
  Top 0.203: v70.65,32.05 v70.65,21.53 62.6,13.49 v62.6,13.32 | v82.27,23.32 85.03,26.08 v106.6,26.08 108.22,27.71 v116.67,27.71 | v26.49,8.73 v31.73,8.73 | v45.62,8.69 v53.14,8.69 | v117.72,63.12 119.86,63.12 v121.02,61.95 | v119.72,47.65 119.72,41.19 v120.33,40.58
  Bottom 0.203: IN_2.1 v70.65,21.53 | v70.65,21.53 | v70.65,32.05 70.65,32.76 AVR.25 | IN_3.1 107.21,25.47 v106.6,26.08 | v82.27,23.32 72.43,23.32 v70.65,21.53 | IN_1.1 v26.48,8.74 v26.49,8.73 | v31.73,8.73 45.58,8.73 v45.62,8.69 | v53.14,8.69 57.97,8.69 v62.6,13.32 | v121.02,61.95 121.02,48.95 v119.72,47.65 | v120.33,40.58 120.33,31.36 v116.67,27.71 | IN_4.1 117.63,63.13 117.7,63.2 v117.72,63.12
IO_CLK  (via drill 0.3)
  Top 0.203: v109.44,23.73 109.44,18.93 v110.26,18.12 | v21.12,6.74 20.39,7.47 v20.39,12.43 21.08,13.12 21.08,16.21 v21.04,16.25 | v93.07,51.63 v93.07,49.03 | v66.5,21.21 66.5,36.2 v63.25,39.45 | v94.94,62.48 94.9,62.48 91.28,58.87 91.28,53.75 v90.47,52.93 | v30.18,31.97 30.18,29.45 21.04,20.31 v21.04,18.2 | v52.16,40.91 53.5,40.91 v61.22,48.63 | v94.66,27.5 88.6,27.5 v87.1,29.01 | v82.83,43.59 82.83,44 80.44,46.39 73.86,46.39 v73.12,45.66 | v77.9,50.95 81.5,50.95 v81.55,51
  Bottom 0.203: IN_4.2 IN_4.15 v94.94,62.48 | v109.44,23.73 IN_3.2 109.44,26.65 108.63,27.46 94.7,27.46 v94.66,27.5 | v110.26,18.12 109.44,18.93 IN_3.15 | IN_2.2 70.61,17.8 70.61,17.79 IN_2.15 66.54,17.8 66.54,21.17 v66.5,21.21 | IN_1.15 21.12,13.16 v20.39,12.43 | v21.12,6.74 IN_1.2 | 68.25,44.48 64.66,40.89 AVR.23 63.25,39.46 v63.25,39.45 | 68.25,44.48 72.76,44.48 | 72.76,44.48 74.99,44.48 75.72,45.22 SR_OUT3.11 75.72,48.79 77.35,50.42 77.37,50.42 v77.9,50.95 | 89.33,50.41 89.38,50.45 | 89.38,50.45 91.16,52.16 | 91.16,52.16 92.54,52.16 v93.07,51.63 | v93.07,49.03 95.71,49.03 96.44,48.3 SR_OUT2.11 | SR_OUT2.11 96.48,47.08 | SR_OUT2.11 | v90.47,52.93 91.16,52.16 | SR_OUT1.11 38.27,40.06 | 38.27,40.06 v30.18,31.97 | 38.27,40.06 51.31,40.06 v52.16,40.91 | v61.22,48.63 64.11,48.63 68.25,44.48 | v87.1,29.01 87.1,40.75 84.78,43.06 83.36,43.06 v82.83,43.59 | v73.12,45.66 72.76,45.26 72.76,44.48 | v81.55,51 87.7,51 88.3,50.4 89.32,50.4 89.38,50.45 | v21.04,16.25 v21.04,18.2
MISO3
  Bottom 0.203: CONNECTOR.79 85.09,77.74 83.95,76.6
  Bottom 0.254: SJ1.1 78.35,71 83.95,76.6
MISO_AVR
  Bottom 0.203: PROGRAMMING_CONNECTOR.9
  Bottom 0.254: 65.35,59.98 ADUM.11 | AVR.16 59.15,44.28 57.77,45.66 57.77,54.03 59.64,55.9 61.51,55.9 63.46,57.85 64.92,57.85 65.33,58.26 65.33,59.71 ADUM.11 | PROGRAMMING_CONNECTOR.9 14.5,81.7 16.29,79.78 16.3,79.52 16.3,74.9 18.3,72.9 21.61,69.59 36.39,69.59 39.4,72.6 52.74,72.6 58.34,67 61.36,63.98 63.91,63.98 65.33,62.56 65.33,59.73 ADUM.11
MOSI3  (via drill 0.3)
  Top 0.254: v78.39,72.3 v82.91,72.3
  Bottom 0.203: CONNECTOR.81 86.36,77.76 84.65,76.05
  Bottom 0.254: SJ2.1 v78.39,72.3 | v82.91,72.3 82.91,74.31 84.65,76.05
MOSI_AVR  (via drill 0.3)
  Top 0.254: PROGRAMMING_CONNECTOR.1 v16.1,73
  Bottom 0.254: AVR.15 58.59,43.71 57.24,45.05 57.24,54.32 59.39,56.47 61.1,56.47 62.81,58.17 ADUM.13 62.81,59.95 62.81,61.83 61.66,62.98 60.79,62.98 57.85,66 57.83,66 52.18,71.57 40.31,71.57 40.25,71.55 | 40.25,71.55 40.04,71.45 36.92,68.33 20.76,68.33 17.3,71.79 17.3,71.8 v16.1,73 | 40.26,71.55 40.25,71.55
N$1  (via drill 0.3)
  Top 0.203: A5.P$2 106.29,5.46 v106.92,6.09
  Bottom 0.203: v106.92,6.09 106.89,6.09 R35.1 112.01,12.98 IN_3.11
N$2  (via drill 0.3)
  Top 0.203: A3.P$2 103.56,12.46 v103.19,12.84
  Bottom 0.203: v103.19,12.84 104.33,13.97 104.29,13.97 | 104.29,13.97 104.24,13.97 | IN_3.12 111.36,17.11 110.5,16.25 106.57,16.25 R36.1 104.29,13.97
N$3
  Bottom 0.203: SR_OUT1.6 38.27,54.2 LCD.14
N$4
  Bottom 0.203: SR_OUT1.5 37.62,54.52 38.59,55.49 38.59,56.94 LCD.13
N$5
  Bottom 0.305: TRIMPOT.2 13.8,54.77 13.08,55.49 13.08,56.95 LCD.3
N$6
  Bottom 0.203: SR_OUT1.7 38.92,52.98 39.49,53.54 40.62,53.54 41.11,53.06 41.11,52.16 41.15,52.12 | 41.15,52.12 41.19,52.08 43.04,52.08 LCD_BACKLIGHT_FET.1 | R49.2 41.14,52.11 41.15,52.12
N$7
  Bottom 0.203: LCD_BACKLIGHT_FET.3 R50.2
N$8
  Bottom 0.203: R50.1 45.73,56.58 LCD.16
  Bottom 0.305: 46.11,56.96 LCD.16
N$9
  Bottom 0.203: SR_OUT1.4 36.97,56.02 LCD.12
N$10
  Bottom 0.203: SR_OUT1.3 36.32,54.13 LCD.11
N$11
  Bottom 0.203: SR_OUT1.2 35.67,52.89 33.72,54.84 22.91,54.84 LCD.6
N$12
  Bottom 0.508: D1.A 117.05,65.95 117.7,65.3 120.81,65.3 POWER_CONNECTOR.P$2
N$13
  Bottom 0.203: SR_OUT1.1 35.02,52.57 33.39,54.19 18.48,54.19 LCD.4
N$14
  Bottom 0.381: C1.+ 108.49,69.71 | D2.C
  Bottom 0.508: VOLTAGE_REGULATOR.1 D1.C 115.41,71.81 114.8,71.2 C3.1 114.73,66.8 113.6,66.8 112.59,67.81 D2.C
  Bottom 0.584: 108.49,69.71 110.4,67.8 D2.C
N$17  (via drill 0.3)
  Top 0.203: E1.B 30.81,4 37.7,10.89 37.74,10.89 49.97,23.12 49.97,23.28 v49.4,23.85 | v59.43,24.9 v59.39,30.75
  Bottom 0.203: v49.4,23.85 51.07,23.85 53.14,21.77 56.83,21.73 59.43,24.33 v59.43,24.9 | v59.39,30.75 59.39,32.36 AVR.32
N$20
  Bottom 0.254: C4.2 49.48,33.39 49.48,33.43 | 49.48,33.43 48.47,34.45 | 48.47,34.49 48.47,34.45 | 49.48,33.43 50.44,33.43 AVR.8 | Y1.1 48.47,34.45
N$21  (via drill 0.3)
  Top 0.254: v79.69,73.64 v88.43,73.64
  Bottom 0.203: v88.43,73.64 89.15,73.64 92.27,76.75 93.31,76.75 94.44,77.89 94.44,79.32 93.7,80.07 87.3,80.07 86.35,79.13 86.36,79.12 CONNECTOR.82
  Bottom 0.254: SJ3.1 v79.69,73.64
N$22  (via drill 0.3)
  Top 0.203: v81.06,74.9 85.64,74.9 v85.67,74.94
  Bottom 0.203: SJ4.1 v81.06,74.9 | CONNECTOR.80 85.09,79.2 86.48,80.59 100.17,80.59 102.83,77.92 102.83,72.86 100.78,70.81 88.72,70.81 85.67,73.89 v85.67,74.94
N$23
  Bottom 0.254: C2.2 54.4,28.52 | Y1.2 55.27,27.6 55.25,27.62 55.25,27.67 54.4,28.52 | 54.4,28.52 54.36,28.52 51.15,31.73 51.15,32.34 52.12,33.31 52.12,33.99 AVR.7
N$24  (via drill 0.3)
  Top 0.203: E1.A 19,4.05 20.39,5.44 31.44,5.44 47.82,21.82 47.82,27.95 v49.36,29.49 | v51.8,29.49 v54.07,31.77
  Bottom 0.203: v49.36,29.49 v51.8,29.49 | v54.07,31.77 54.62,31.22 54.68,31.22 54.75,31.15 56.5,31.15 58.6,33.25 58.7,33.75 59.15,34.2 59.12,34.2 | 59.1,34.2 59.12,34.2 | 59.12,34.2 AVR.1
N$25  (via drill 0.3)
  Top 0.203: E2.B 42.5,14.22 51.02,22.75 51.02,27.22 v55.63,31.82
  Bottom 0.203: v55.63,31.82 55.98,32.19 56.29,32.19 57.95,33.9 58,34.21 AVR.2
N$27  (via drill 0.3)
  Top 0.203: E2.A 37.5,9.92 50.54,22.95 50.54,35.55 v52.89,37.9
  Bottom 0.203: v52.89,37.9 52.89,38 AVR.9
N$28  (via drill 0.3)
  Top 0.203: v125.7,63.1 125.7,61.9
  Top 0.508: LED1.C 125.7,61.9
  Bottom 0.203: R52.2 124,61.9
  Bottom 0.254: 124,61.9 124,62.8 124.3,63.1 v125.7,63.1
N$29  (via drill 0.3)
  Top 0.254: v65.16,72.3 63.15,72.3 v62.79,71.94
  Bottom 0.254: SJ2.2 v65.16,72.3 | v62.79,71.94 62.79,69.15 62.82,69.12 ADUM.4 | ADUM.4 | ADUM.4
N$30  (via drill 0.3)
  Top 0.203: E3.A 56,15.86 57.93,17.79 57.93,37.66 v56.71,38.88
  Bottom 0.203: v56.71,38.88 56.71,39.91 AVR.10
N$31
  Bottom 0.254: SJ1.2 65.62,71 65.36,70.74 65.36,69.14 ADUM.6
N$32  (via drill 0.3)
  Top 0.203: E3.B 61,15.25 58.46,17.79 58.46,38.15 59.23,38.92 59.23,39.41 v58.58,40.06
  Bottom 0.203: v58.58,40.06 57.7,40.06 AVR.11
N$33
  Bottom 0.203: SR_OUT2.15 99.05,43.79 100.34,42.49 100.34,35.1 95.79,30.55 93.97,30.55 R7.1
N$34
  Bottom 0.203: SR_OUT2.1 99.7,36 95.79,32.09 R8.1
N$35
  Bottom 0.203: SR_OUT2.2 99.05,36.89 95.79,33.64 93.97,33.64 R9.1
N$36
  Bottom 0.203: SR_OUT2.3 98.4,37.71 95.79,35.1 R10.1
N$37
  Bottom 0.203: SR_OUT2.4 97.75,38.52 95.79,36.56 93.96,36.56 R11.1
N$38
  Bottom 0.203: SR_OUT2.5 97.1,39.41 95.79,38.11 93.94,38.11 R12.1
N$39
  Bottom 0.203: SR_OUT2.6 96.45,40.23 96.44,40.22 96.44,39.37 95.75,38.67 94.94,38.67 94.25,39.37 93.95,39.37 R13.1
N$40  (via drill 0.3)
  Top 0.203: v97.09,43.96 v97.09,48.59
  Bottom 0.203: SR_OUT2.7 95.8,43.96 v97.09,43.96 | R14.1 93.92,42.25 92.87,43.31 91,43.31 89.29,45.01 89.29,47.61 91.45,49.77 96.28,49.77 97.09,48.95 v97.09,48.59
N$41  (via drill 0.3)
  Top 0.406: LED17.A v91.2,30.59
  Bottom 0.406: v91.2,30.59 R7.2
N$42  (via drill 0.3)
  Top 0.406: LED18.A v91.2,32.09
  Bottom 0.406: v91.2,32.09 R8.2
N$43  (via drill 0.3)
  Top 0.406: LED19.A v91.2,33.59
  Bottom 0.406: v91.2,33.59 R9.2
N$44  (via drill 0.3)
  Top 0.406: LED20.A v91.2,35.09
  Bottom 0.406: v91.2,35.09 R10.2
N$45  (via drill 0.3)
  Top 0.406: LED21.A v91.2,36.59
  Bottom 0.406: v91.2,36.59 R11.2
N$46  (via drill 0.3)
  Top 0.406: LED22.A v91.2,38.09
  Bottom 0.406: v91.2,38.09 R12.2
N$47  (via drill 0.3)
  Top 0.406: LED23.A v91.2,39.59
  Bottom 0.203: 92.2,39.59 92.22,39.57 92.22,39.59 R13.2
  Bottom 0.406: v91.2,39.59 92.2,39.59
N$48  (via drill 0.3)
  Top 0.406: LED24.A v91.2,41.09
  Bottom 0.406: v91.2,41.09 R14.2
N$49
  Bottom 0.203: SR_OUT3.15 78.33,44.04 80.28,42.09 80.28,41.14 R17.1
N$50
  Bottom 0.203: SR_OUT3.1 78.97,40.06 79.46,39.57 80.25,39.57 | 80.28,39.57 80.25,39.57 | 80.25,39.57 R18.1
N$51
  Bottom 0.203: SR_OUT3.2 78.33,39.24 79.46,38.11 80.21,38.11 R19.1
N$52
  Bottom 0.203: SR_OUT3.3 77.67,38.35 79.46,36.56 80.19,36.56 R20.1
N$53
  Bottom 0.203: SR_OUT3.4 77.03,37.54 79.46,35.1 80.22,35.1 R21.1
N$54
  Bottom 0.203: SR_OUT3.5 76.38,36.64 79.46,33.56 80.19,33.56 R22.1
N$55
  Bottom 0.203: SR_OUT3.6 75.72,35.83 79.46,32.09 R23.1
N$56
  Bottom 0.203: SR_OUT3.7 75.08,35.02 79.46,30.63 80.19,30.63 R24.1
N$57  (via drill 0.3)
  Top 0.406: v82.95,41.09 LED25.A 84.08,41.09
  Bottom 0.406: R17.2 v82.95,41.09
N$58  (via drill 0.3)
  Top 0.406: LED26.A v82.95,39.59
  Bottom 0.406: v82.95,39.59 R18.2
N$59  (via drill 0.3)
  Top 0.406: v82.95,38.09 LED27.A
  Bottom 0.406: R19.2 v82.95,38.09
N$60  (via drill 0.3)
  Top 0.406: v82.95,36.59 LED28.A
  Bottom 0.406: R20.2 v82.95,36.59
N$61  (via drill 0.3)
  Top 0.406: v82.95,35.09 LED29.A
  Bottom 0.406: R21.2 v82.95,35.09
N$62  (via drill 0.3)
  Top 0.406: v82.95,33.59 LED30.A
  Bottom 0.406: R22.2 v82.95,33.59
N$63  (via drill 0.3)
  Top 0.406: v82.95,32.09 LED31.A
  Bottom 0.406: R23.2 v82.95,32.09
N$64  (via drill 0.3)
  Top 0.406: v82.95,30.59 LED32.A
  Bottom 0.406: R24.2 v82.95,30.59
N$65  (via drill 0.3)
  Top 0.254: v34.73,64.92 45.7,64.92 v51.84,58.78 | v57.85,57.73 61.42,57.73 v63.62,55.53 | v68.7,49.93 68.7,48.95 65.61,45.87 65.61,44.28 69.55,40.34 69.55,39.65 68.13,38.23 66.95,38.23 63.74,41.44 61.83,41.44 v61.18,40.79
  Bottom 0.254: v34.73,64.92 34.66,65 34.65,65 | v51.84,58.78 56.79,58.78 v57.85,57.73 | v63.62,55.53 63.62,55.01 v68.7,49.93 | v61.18,40.79 61.18,39.37 62.2,38.35 62.2,36.69 AVR.29 | D3.A 17.6,68 20.6,65 34.65,65 | 34.65,65 v34.73,64.92
  Bottom 0.406: D3.A 15.5,66 15.5,65.5 D4.A 12.35,65.65 R51.1
N$67  (via drill 0.3)
  Top 0.254: RESET.P$4 17.76,67.06 17.5,66.8 v17.5,65.9
  Top 1.42: RESET.P$3 RESET.P$4
  Bottom 0.254: v17.5,65.9 D3.C
N$266  (via drill 3.65 pad 7.8)  (1 unrouted)
  other vias: 28.62,75.15 98.35,75.15
OUT
  Bottom 0.203: AVR.26 64.66,37.64 63.86,38.43 63.86,38.76 64.31,39.2 65.28,39.2 69.43,43.35 75.6,43.35 77.67,45.42 SR_OUT3.14
OUT_DAISY  (via drill 0.3)
  Top 0.203: v91.04,50.33 90.35,49.68 v87.3,49.68 | v99.65,49.64 99.65,51.47 v99.61,51.59 | v75.52,49.68 v82.14,49.68
  Bottom 0.203: SR_OUT3.9 74.42,48.59 v75.52,49.68 | 98.39,47.04 SR_OUT2.14 | SR_OUT2.14 | SR_OUT2.14 98.39,48.38 v99.65,49.64 | v99.61,51.59 98.47,51.59 97.22,50.33 v91.04,50.33 | v82.14,49.68 v87.3,49.68
OUT_DAISY2  (via drill 0.3)
  Top 0.203: v90.96,48.22 v82.14,48.22 | v61.3,53.3 55.09,53.3 v50.7,48.91 | v41.97,42.82 37.01,42.82 v36.32,43.51 | v69.35,46.23 71.47,46.23 73.7,44 80.64,44 v80.68,43.96
  Bottom 0.203: SR_OUT2.9 93.61,47.08 92.46,48.22 v90.96,48.22 | v82.14,48.22 82.14,45.42 v80.68,43.96 | v69.35,46.23 68.37,46.23 v61.3,53.3 | v50.7,48.91 48.06,48.91 v41.97,42.82 | v36.32,43.51 SR_OUT1.14
OUT_LATCH  (via drill 0.3)
  Top 0.203: v90.35,47.25 v87.18,47.25 | v84.34,47.25 78.57,47.25 v76.94,48.91 75.2,47.17 v71.74,47.17 | v36.77,41.48 47.65,41.48 v49.24,43.06 | v55.86,49.48 57.81,49.48 v60.37,52.04
  Bottom 0.203: AVR.24 65.22,40.32 68.82,43.92 75.08,43.92 76.38,45.22 SR_OUT3.12 76.38,46.96 | SR_OUT2.12 97.1,45.26 96.4,44.57 94.17,44.57 93.15,45.58 93.15,46.48 92.38,47.25 v90.35,47.25 | v87.18,47.25 v84.34,47.25 | v76.94,48.91 76.94,48.95 76.38,48.34 76.38,46.96 | 76.38,46.96 76.33,46.92 | SR_OUT1.12 37.62,42.33 v36.77,41.48 | v49.24,43.06 49.44,43.06 v55.86,49.48 | v60.37,52.04 61.59,52.04 68.17,45.46 70.04,45.46 v71.74,47.17
RESET
  Bottom 0.406: D4.C 14,70.5 15,71.5 15,76.13 PROGRAMMING_CONNECTOR.5
RX  (via drill 0.3)
  Top 0.203: PROGRAMMING_CONNECTOR.10 7.64,80.28 7.07,79.75 6.5,79.26 6.5,60.86 4.47,58.83 4.47,56.63 6.5,54.6 6.5,50.66 v6.66,50.5 | v13.41,42.09 31.16,42.09 v36.77,36.48 | v43.55,36.77 50.21,36.77 v50.94,37.5 | v52.41,36.44 54.27,36.44 56.72,33.99 57.12,33.59 v57.12,29.98 | v60.41,29.66 61.55,30.79 61.55,32.42 61.02,32.95 v61.02,36.73
  Bottom 0.203: v6.66,50.5 6.66,48.83 v13.41,42.09 | v36.77,36.48 43.27,36.48 v43.55,36.77 | v50.94,37.5 51.35,37.5 v52.41,36.44 | v57.12,29.98 57.44,29.66 v60.41,29.66 | v61.02,36.73 62.36,35.38 | 62.44,35.3 62.4,35.34 | AVR.30 62.36,35.38 | 62.36,35.38 62.36,35.47 62.4,35.42 62.4,35.34 | 62.4,35.34 AVR.30 | AVR.30
SCK_AVR  (via drill 0.3)
  Top 0.254: v64.11,56.96 v64.11,62.73
  Bottom 0.203: PROGRAMMING_CONNECTOR.7 13.08,80.62
  Bottom 0.254: AVR.17 61.24,44.26 58.3,47.21 58.3,53.58 59.96,55.25 61.67,55.25 63.38,56.96 v64.11,56.96 | 64.07,59.88 64.05,59.9 ADUM.12 64.03,59.76 64.03,61.83 63.62,62.24 | 13.08,80.62 15.7,78 15.7,74.5 17.9,72.3 17.9,72.29 21.25,68.94 36.62,68.94 38.21,70.53 39.9,72.1 52.46,72.1 61.07,63.49 62.36,63.49 63.62,62.24 | v64.11,62.73 63.62,62.24
SS3
  Bottom 0.254: SJ4.2 64.35,74.9 61.52,72.08 ADUM.3 | ADUM.3 | ADUM.3
SS_AVR
  Bottom 0.254: AVR.14 56.67,44.48 56.67,54.72 58.99,57.04 60.45,57.04 61.51,58.09 61.51,59.7 ADUM.14
TX  (via drill 0.3)
  Top 0.203: PROGRAMMING_CONNECTOR.8 10.42,80.62 7.03,77.23 7.03,60.12 v5.4,58.5 | v12.59,40.95 31.04,40.95 40.67,31.32 41.44,31.32 v46.56,26.2 | v60.12,26.77 60.77,26.77 v61.63,27.62
  Bottom 0.203: v5.4,58.5 5.4,48.14 v12.59,40.95 | AVR.31 61.85,34.79 62.89,33.76 62.89,30.39 61.63,29.13 v61.63,27.62 | v46.56,26.2 49.44,26.2 53.46,22.18 56.67,22.18 58.58,24.09 58.58,25.23 v60.12,26.77
(copper drawn outside any net)
  shapes: Bottom area x1, Bottom circle x15, Top area x1, Top circle x4

## Text on the board
Top: RX | MISO | TX | SCK | GND | RESET | GND | GND | 5V | MOSI | 7 | 8 | 9 | 4 | 5 | 6 | 1 | 2 | 3 | + | - | 0 | . | C | D | A | B
Bottom: SS | SCK | MOSI | MISO | Controller | DSP | REV B | Tibor | Simon | 2013
tStop: 7 | 8 | 9 | 4 | 5 | 6 | 1 | 2 | 3 | + | - | 0 | . | C | D | A | B